# Altium schematic sheet power.SchDoc
size A4
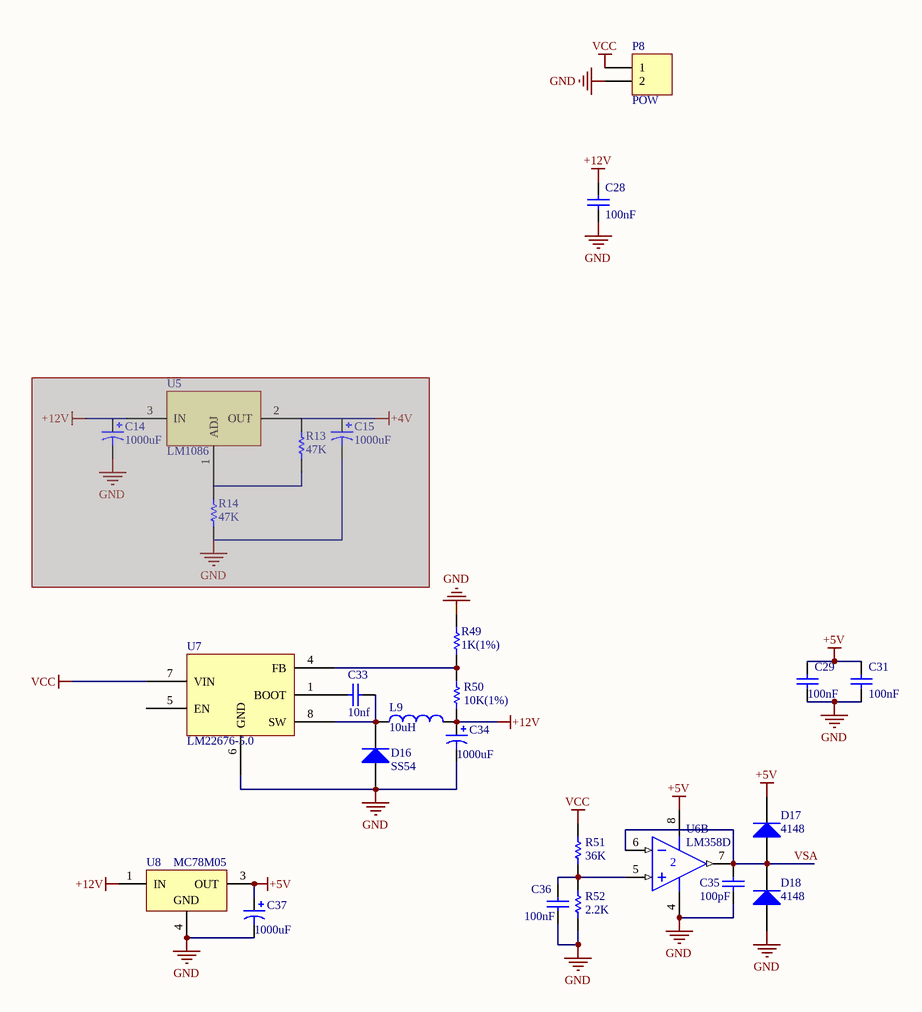
[diagram p0: power.SchDoc]

## Parts
C14  value 1000uF  [C16-7.5]  (hidden comment: Cap Pol3)  (masked out: inside a compile mask, not in the netlist)
C15  value 1000uF  [C16-7.5]  (hidden comment: Cap Pol3)  (masked out: inside a compile mask, not in the netlist)
C28  value 100nF  [0603]  (hidden comment: Cap)
C29  value 100nF  [0603]  (hidden comment: Cap)
C31  value 100nF  [0603]  (hidden comment: Cap)
C33  value 10nf  [0603]  (hidden comment: Cap)
C34  value 1000uF  [C8x4]  (hidden comment: Cap Pol1)
C35  value 100pF  [0603]  (hidden comment: Cap)
C36  value 100nF  [0603]  (hidden comment: Cap)
C37  value 1000uF  [C8x4]  (hidden comment: Cap Pol1)
D16  SS54  [SMB]
D17  4148  [LL34]
D18  4148  [LL34]
L9  value 10uH  [L-6045]  (hidden comment: Inductor)
P8  POW  [MG7.62-2P]
R13  value 47K  [1608[0603]]  (hidden comment: Res1)  (masked out: inside a compile mask, not in the netlist)
R14  value 47K  [1608[0603]]  (hidden comment: Res1)  (masked out: inside a compile mask, not in the netlist)
R49  value 1K(1%)  [0603]  (hidden comment: Res1)
R50  value 10K(1%)  [0603]  (hidden comment: Res1)
R51  value 36K  [0603]  (hidden comment: Res1)
R52  value 2.2K  [0603]  (hidden comment: Res1)
U5  LM1086  [TO-263AB]  (masked out: inside a compile mask, not in the netlist)
U6  LM358D  [SOIC8]  (part B of 2)
U7  LM22676-5.0  [SOP8-POW]
U8  MC78M05  [369A-13]

## Nets
+5V: C29.1 C31.1 C37.1 D17.2(K) U6.8(V+) U8.3(OUT)
+12V: C28.1 C34.1 L9.2 R50.1 U8.1(IN)
GND: C28.2 C29.2 C31.2 C34.2 C35.1 C36.2 C37.2 D16.1(A) D18.1(A) P8.2 R49.1 R52.1 U6.4(V-) U7.6(GND) U8.4(GND)
VCC: P8.1 R51.2 U7.7(VIN)
VSA: C35.2 D17.1(A) D18.2(K) U6.6(IN-) U6.7(OUT)
NetC33_1: C33.1 D16.2(K) L9.1 U7.8(SW)
NetC33_2: C33.2 U7.1(BOOT)
NetC36_1: C36.1 R51.1 R52.2 U6.5(IN+)
NetR49_2: R49.2 R50.2 U7.4(FB)

Not connected (* = marked no-connect by the designer): U7 2(NC) 3(NC) 5(EN)

## Library data of the parts
C14 C15 = Cap Pol3: Polarized Capacitor (Surface Mount); Published: 8-Jun-2000; LatestRevisionDate: 17-Jul-2002; LatestRevisionNote: Re-released for DXP Platform.; PackageReference: C0805; Publisher: Altium Limited
C28 C29 C31 C33 C35 C36 = Cap: Capacitor; Published: 8-Jun-2000; LatestRevisionDate: 17-Jul-2002; LatestRevisionNote: Re-released for DXP Platform.; PackageReference: RAD-0.3; Publisher: Altium Limited
C34 C37 = Cap Pol1: Polarized Capacitor (Radial); pin to pad: 1>2 2>1; Published: 8-Jun-2000; LatestRevisionDate: 17-Jul-2002; LatestRevisionNote: Re-released for DXP Platform.; PackageReference: RB7.6-15; Publisher: Altium Limited
D16 = Diode 1N5408: 3 Amp Medium Power Silicon Rectifier Diode; Published: 8-Jun-2000; LatestRevisionDate: 17-Jul-2002; LatestRevisionNote: Re-released for DXP Platform.; DatasheetDocument: Aug-1984; PackageReference: DO-201AD; Publisher: Altium Limited; ComponentLink1Description: Manufacturer Link; ComponentLink1URL: http://www.irf.com/; Value: SS54
D17 D18 = Diode 1N5408: 3 Amp Medium Power Silicon Rectifier Diode; Value: 1N4148; Published: 8-Jun-2000; LatestRevisionDate: 17-Jul-2002; LatestRevisionNote: Re-released for DXP Platform.; DatasheetDocument: Aug-1984; PackageReference: DO-201AD; Publisher: Altium Limited; ComponentLink1Description: Manufacturer Link; ComponentLink1URL: http://www.irf.com/
L9 = Inductor: Code_IEC: 1005; Published: 8-Jun-2000; LatestRevisionDate: 17-Jul-2002; LatestRevisionNote: Re-released for DXP Platform.; PackageReference: 0402-A; Publisher: Altium Limited; Code_JEITA: 0402
P8 = Header 2: Header, 2-Pin; LatestRevisionDate: 17-Jul-2002; LatestRevisionNote: Re-released for DXP Platform.; Publisher: Altium Limited
R13 R14 R49-R52 = Res1: Resistor; Published: 8-Jun-2000; LatestRevisionDate: 17-Jul-2002; LatestRevisionNote: Re-released for DXP Platform.; PackageReference: AXIAL-0.3; Publisher: Altium Limited
U6 = LM358D: Dual Low-Power Operational Amplifier; Published: 17-Jul-2002; LatestRevisionDate: 13-Apr-2006; LatestRevisionNote: IPC-7351 Footprint Added.; DatasheetVersion: 1988; PackageReference: 751-02; Publisher: Altium Limited; PackageDescription: 8-Pin Small Outline Integrated Circuit 1.27 mm Pitch; Code_JEDEC: MS-012-AA; Code_IPC: SOIC127P600-8; ComponentLink1Description: Manufacturer Link; ComponentLink1URL: http://www.onsemi.com/site/products/parametrics/0,4446,251,00.html; ComponentLink2Description: Datasheet; ComponentLink2URL: http://www.onsemi.com/pub/Collateral/LM358-D.PDF
U8 = MC78M05BDTRK: Three-Terminal Medium Current Positive Voltage Regulator; Note: Pin 2 is electrically connected to Pin 4; Pin 2 is trimmed and not drawn;; Published: 15-Apr-2002; DatasheetVersion: Apr-2000; PackageVersion: 1997; PackageReference: 369A-13; Publisher: Altium Limited; PackageDescription: D-PAK/TO-252-AA; 3 Leads (1 Cropped); Body 10.3 (inc. leads) x 6.7 mm (LxW max); ComponentLink1Description: Manufacturer Link; ComponentLink1URL: http://www.onsemi.com/site/products/taxonomy/0,4438,503,00.html; ComponentLink2Description: Datasheet; ComponentLink2URL: http://www.onsemi.com/pub/Collateral/MC78M00-D.PDF